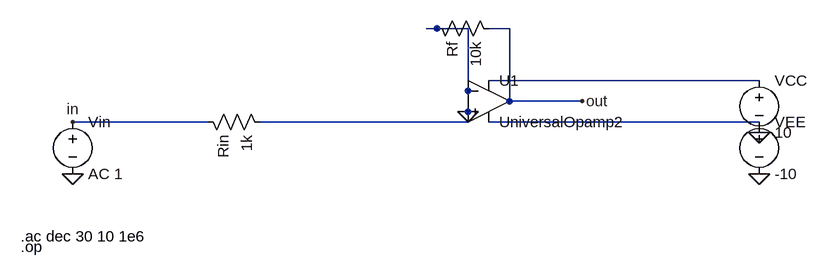
[diagram p0: schematic inverting_opamp_ac.asc]
inverting_opamp_ac.asc, the LTspice schematic file:
Version 4
SHEET 1 1900 1200
WIRE 128 320 336 320
WIRE 416 320 736 320
WIRE 736 320 736 272
WIRE 736 272 736 176
WIRE 736 176 672 176
WIRE 800 288 800 176
WIRE 800 176 768 176
WIRE 1184 256 768 256
WIRE 1184 320 768 320
WIRE 800 288 912 288
FLAG 128 320 in
FLAG 912 288 out
FLAG 736 304 0
FLAG 128 400 0
FLAG 1184 336 0
FLAG 1184 400 0
SYMBOL voltage 128 304 R0
SYMATTR InstName Vin
SYMATTR Value AC 1
SYMBOL res 320 304 M90
SYMATTR InstName Rin
SYMATTR Value 1k
SYMBOL UniversalOpAmp2 768 288 R0
SYMATTR InstName U1
SYMATTR Value UniversalOpamp2
SYMBOL res 672 160 M90
SYMATTR InstName Rf
SYMATTR Value 10k
SYMBOL voltage 1184 240 R0
SYMATTR InstName VCC
SYMATTR Value 10
SYMBOL voltage 1184 304 R0
SYMATTR InstName VEE
SYMATTR Value -10
TEXT 48 496 Left 2 !.ac dec 30 10 1e6
TEXT 48 512 Left 2 !.op

The netlist it stands for:
* inverting_opamp_ac.asc
Vin in 0 AC 1
Rin in 0 1k
XU1 0 0 N001 N002 out level2 UniversalOpamp2 Avol=1Meg GBW=10Meg Slew=10Meg Ilimit=25m Rail=0 Vos=0 En=0 Enk=0 In=0 Ink=0 Rin=500Meg  ; pins In+ In- V+ V- OUT
Rf 0 out 10k
VCC N001 0 10
VEE N002 0 -10
.ac dec 30 10 1e6
.op
.lib UniversalOpAmp2.lib
.backanno
.end